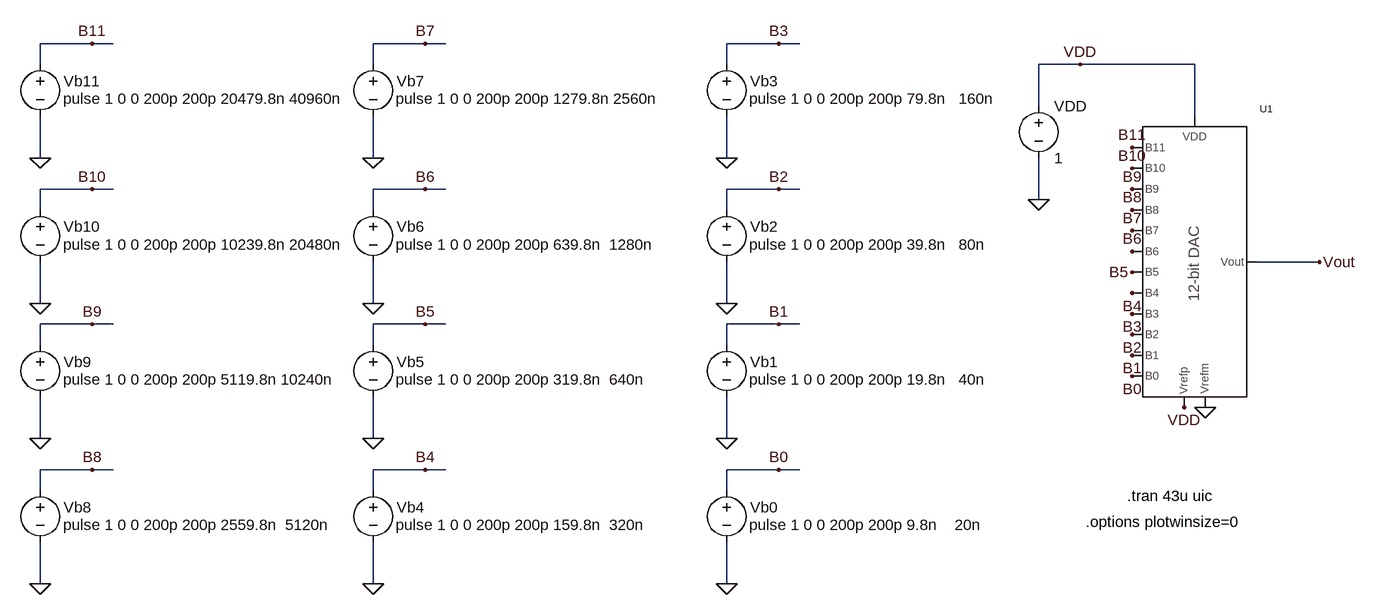
[diagram p0: schematic _Fig4_1_ideal_DAC.asc]
_Fig4_1_ideal_DAC.asc, the LTspice schematic file:
Version 4
SHEET 1 2732 1316
WIRE -1328 -128 -1408 -128
WIRE -1296 -128 -1328 -128
WIRE -816 -128 -896 -128
WIRE -784 -128 -816 -128
WIRE -272 -128 -352 -128
WIRE -240 -128 -272 -128
WIRE -1408 -96 -1408 -128
WIRE -896 -96 -896 -128
WIRE -352 -96 -352 -128
WIRE 192 -96 128 -96
WIRE 368 -96 192 -96
WIRE 128 -32 128 -96
WIRE 368 -16 368 -96
WIRE -1408 48 -1408 -16
WIRE -896 48 -896 -16
WIRE -352 48 -352 -16
WIRE -1328 96 -1408 96
WIRE -1296 96 -1328 96
WIRE -816 96 -896 96
WIRE -784 96 -816 96
WIRE -272 96 -352 96
WIRE -240 96 -272 96
WIRE 128 112 128 48
WIRE -1408 128 -1408 96
WIRE -896 128 -896 96
WIRE -352 128 -352 96
WIRE 560 208 464 208
WIRE -1408 272 -1408 208
WIRE -896 272 -896 208
WIRE -352 272 -352 208
WIRE -1328 304 -1408 304
WIRE -1296 304 -1328 304
WIRE -816 304 -896 304
WIRE -784 304 -816 304
WIRE -272 304 -352 304
WIRE -240 304 -272 304
WIRE -1408 336 -1408 304
WIRE -896 336 -896 304
WIRE -352 336 -352 304
WIRE -1408 480 -1408 416
WIRE -896 480 -896 416
WIRE -352 480 -352 416
WIRE -1328 528 -1408 528
WIRE -1296 528 -1328 528
WIRE -816 528 -896 528
WIRE -784 528 -816 528
WIRE -272 528 -352 528
WIRE -240 528 -272 528
WIRE -1408 560 -1408 528
WIRE -896 560 -896 528
WIRE -352 560 -352 528
WIRE -1408 704 -1408 640
WIRE -896 704 -896 640
WIRE -352 704 -352 640
FLAG -896 48 0
FLAG -816 -128 B7
FLAG -896 272 0
FLAG -816 96 B6
FLAG -896 480 0
FLAG -816 304 B5
FLAG -896 704 0
FLAG -816 528 B4
FLAG -352 48 0
FLAG -272 -128 B3
FLAG -352 272 0
FLAG -272 96 B2
FLAG -352 480 0
FLAG -272 304 B1
FLAG -352 704 0
FLAG -272 528 B0
FLAG 128 112 0
FLAG 192 -96 VDD
FLAG 560 208 Vout
FLAG 352 432 VDD
FLAG 384 432 0
FLAG 272 160 B7
FLAG 272 192 B6
FLAG 272 224 B5
FLAG 272 256 B4
FLAG 272 288 B3
FLAG 272 320 B2
FLAG 272 352 B1
FLAG 272 384 B0
FLAG 272 128 B8
FLAG 272 96 B9
FLAG 272 64 B10
FLAG 272 32 B11
FLAG -1408 48 0
FLAG -1328 -128 B11
FLAG -1408 272 0
FLAG -1328 96 B10
FLAG -1408 480 0
FLAG -1328 304 B9
FLAG -1408 704 0
FLAG -1328 528 B8
SYMBOL voltage -896 -112 R0
WINDOW 0 36 42 Left 0
WINDOW 3 35 69 Left 0
WINDOW 123 0 0 Left 0
WINDOW 39 0 0 Left 0
SYMATTR InstName Vb7
SYMATTR Value pulse 1 0 0 200p 200p 1279.8n 2560n
SYMBOL voltage -896 112 R0
WINDOW 0 36 42 Left 0
WINDOW 3 35 69 Left 0
WINDOW 123 0 0 Left 0
WINDOW 39 0 0 Left 0
SYMATTR InstName Vb6
SYMATTR Value pulse 1 0 0 200p 200p 639.8n  1280n
SYMBOL voltage -896 320 R0
WINDOW 0 36 42 Left 0
WINDOW 3 35 69 Left 0
WINDOW 123 0 0 Left 0
WINDOW 39 0 0 Left 0
SYMATTR InstName Vb5
SYMATTR Value pulse 1 0 0 200p 200p 319.8n  640n
SYMBOL voltage -896 544 R0
WINDOW 0 36 42 Left 0
WINDOW 3 35 69 Left 0
WINDOW 123 0 0 Left 0
WINDOW 39 0 0 Left 0
SYMATTR InstName Vb4
SYMATTR Value pulse 1 0 0 200p 200p 159.8n  320n
SYMBOL voltage -352 -112 R0
WINDOW 0 36 42 Left 0
WINDOW 3 35 69 Left 0
WINDOW 123 0 0 Left 0
WINDOW 39 0 0 Left 0
SYMATTR InstName Vb3
SYMATTR Value pulse 1 0 0 200p 200p 79.8n   160n
SYMBOL voltage -352 112 R0
WINDOW 0 36 42 Left 0
WINDOW 3 35 69 Left 0
WINDOW 123 0 0 Left 0
WINDOW 39 0 0 Left 0
SYMATTR InstName Vb2
SYMATTR Value pulse 1 0 0 200p 200p 39.8n   80n
SYMBOL voltage -352 320 R0
WINDOW 0 36 42 Left 0
WINDOW 3 35 69 Left 0
WINDOW 123 0 0 Left 0
WINDOW 39 0 0 Left 0
SYMATTR InstName Vb1
SYMATTR Value pulse 1 0 0 200p 200p 19.8n   40n
SYMBOL voltage -352 544 R0
WINDOW 0 36 42 Left 0
WINDOW 3 35 69 Left 0
WINDOW 123 0 0 Left 0
WINDOW 39 0 0 Left 0
SYMATTR InstName Vb0
SYMATTR Value pulse 1 0 0 200p 200p 9.8n    20n
SYMBOL voltage 128 -48 R0
WINDOW 123 0 0 Left 0
WINDOW 39 0 0 Left 0
SYMATTR InstName VDD
SYMATTR Value 1
SYMBOL Ideal_12_bit_DAC 288 416 R0
SYMATTR InstName U1
SYMBOL voltage -1408 -112 R0
WINDOW 0 36 42 Left 0
WINDOW 3 35 69 Left 0
WINDOW 123 0 0 Left 0
WINDOW 39 0 0 Left 0
SYMATTR InstName Vb11
SYMATTR Value pulse 1 0 0 200p 200p 20479.8n 40960n
SYMBOL voltage -1408 112 R0
WINDOW 0 36 42 Left 0
WINDOW 3 35 69 Left 0
WINDOW 123 0 0 Left 0
WINDOW 39 0 0 Left 0
SYMATTR InstName Vb10
SYMATTR Value pulse 1 0 0 200p 200p 10239.8n 20480n
SYMBOL voltage -1408 320 R0
WINDOW 0 36 42 Left 0
WINDOW 3 35 69 Left 0
WINDOW 123 0 0 Left 0
WINDOW 39 0 0 Left 0
SYMATTR InstName Vb9
SYMATTR Value pulse 1 0 0 200p 200p 5119.8n 10240n
SYMBOL voltage -1408 544 R0
WINDOW 0 36 42 Left 0
WINDOW 3 35 69 Left 0
WINDOW 123 0 0 Left 0
WINDOW 39 0 0 Left 0
SYMATTR InstName Vb8
SYMATTR Value pulse 1 0 0 200p 200p 2559.8n  5120n
TEXT 264 568 Left 0 !.tran 43u uic
TEXT 200 608 Left 0 !.options plotwinsize=0

The netlist it stands for:
* _Fig4_1_ideal_DAC.asc
Vb7 B7 0 pulse 1 0 0 200p 200p 1279.8n 2560n
Vb6 B6 0 pulse 1 0 0 200p 200p 639.8n  1280n
Vb5 B5 0 pulse 1 0 0 200p 200p 319.8n  640n
Vb4 B4 0 pulse 1 0 0 200p 200p 159.8n  320n
Vb3 B3 0 pulse 1 0 0 200p 200p 79.8n   160n
Vb2 B2 0 pulse 1 0 0 200p 200p 39.8n   80n
Vb1 B1 0 pulse 1 0 0 200p 200p 19.8n   40n
Vb0 B0 0 pulse 1 0 0 200p 200p 9.8n    20n
VDD VDD 0 1
XU1 B11 B10 B9 B8 B7 B6 B5 B4 B3 B2 B1 B0 Vout VDD 0 VDD Ideal_12_bit_DAC  ; pins B11 B10 B9 B8 B7 B6 B5 B4 B3 B2 B1 B0 Vout Vrefp Vrefm VDD
Vb11 B11 0 pulse 1 0 0 200p 200p 20479.8n 40960n
Vb10 B10 0 pulse 1 0 0 200p 200p 10239.8n 20480n
Vb9 B9 0 pulse 1 0 0 200p 200p 5119.8n 10240n
Vb8 B8 0 pulse 1 0 0 200p 200p 2559.8n  5120n
.tran 43u uic
.options plotwinsize=0
.backanno
.end